# Altium schematic sheet Accelerometer.SchDoc
size A4; SheetNumber: 5; SheetTotal: 6
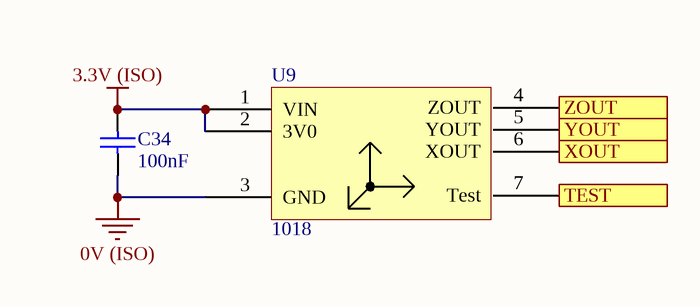
[diagram p0: Accelerometer.SchDoc]

## Parts
C34  100nF  [0805]
U9  1018  [Adafruit 1018]

## Ports
TEST, XOUT (out), YOUT (out), ZOUT (out)

## Nets
0V (ISO): C34.1 U9.3(GND)
3.3V (ISO): C34.2 U9.1(VIN) U9.2(3V0)
TEST: U9.7(Test) ; port TEST
XOUT: U9.6(XOUT) ; port XOUT
YOUT: U9.5(YOUT) ; port YOUT
ZOUT: U9.4(ZOUT) ; port ZOUT

## Library data of the parts
C34 = GCM21BR71E104KA37L: Manufacturer: muRata; Tolerance: 10%; Material: X7R; Rated Voltage: 25V; Part Number: GCM21BR71E104KA37L; Value: 100nF; Digikey Part Number: DO NOT USE FOR NEW DESIGNS
U9 = 1018: ADXL326 series Accelerometer, 3 Axis Sensor Evaluation Board; Manufacturer: Adafruit; Part Number: 1018; Supplier Part Number: 1528-1011-ND; Link: https://www.digikey.com/en/products/detail/adafruit-industries-llc/1018/4990760